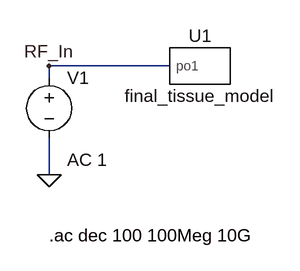
[diagram p0: schematic tissue_testbench.asc.asc]
tissue_testbench.asc.asc, the LTspice schematic file:
Version 4.1
SHEET 1 880 680
WIRE 176 160 16 160
WIRE 16 176 16 160
WIRE 16 304 16 256
FLAG 16 304 0
FLAG 16 160 RF_In
SYMBOL final_tissue_model 208 160 R0
SYMATTR InstName U1
SYMBOL voltage 16 160 R0
WINDOW 123 24 124 Left 2
WINDOW 39 0 0 Left 0
SYMATTR InstName V1
SYMATTR Value ""
SYMATTR Value2 AC 1
TEXT 16 384 Left 2 !.ac dec 100 100Meg 10G

The netlist it stands for:
* tissue_testbench.asc.asc
X§U1 RF_In final_tissue_model  ; pins po1
V1 RF_In 0 AC 1
.ac dec 100 100Meg 10G
.lib C:\Users\vikra\OneDrive\Documents\MATLAB\Akinwande Lab\output\final_tissue_model.sp
.backanno
.end